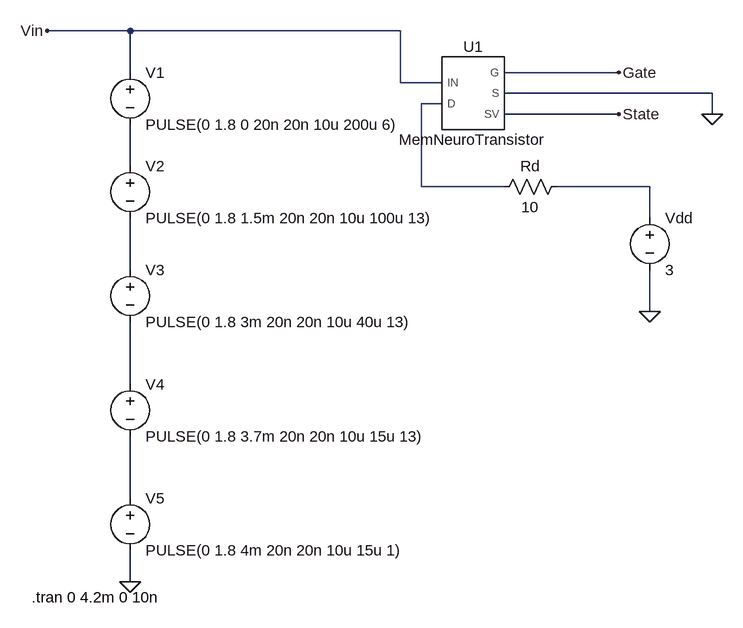
[diagram p0: schematic memNeuroTransistor.asc]
memNeuroTransistor.asc, the LTspice schematic file:
Version 4
SHEET 1 880 744
WIRE -304 -144 -432 -144
WIRE 112 -144 -304 -144
WIRE -304 -80 -304 -144
WIRE 448 -80 272 -80
WIRE 112 -64 112 -144
WIRE 176 -64 112 -64
WIRE 592 -48 272 -48
WIRE 176 -32 144 -32
WIRE 448 -16 272 -16
WIRE 592 -16 592 -48
WIRE -304 64 -304 0
WIRE 144 96 144 -32
WIRE 272 96 144 96
WIRE 496 96 352 96
WIRE 496 144 496 96
WIRE -304 224 -304 144
WIRE 496 288 496 224
WIRE -304 400 -304 304
WIRE -304 576 -304 480
WIRE -304 704 -304 656
FLAG -304 704 0
FLAG 448 -16 State
FLAG 448 -80 Gate
FLAG -432 -144 Vin
FLAG 496 288 0
FLAG 592 -16 0
SYMBOL voltage -304 -96 R0
WINDOW 123 0 0 Left 0
WINDOW 39 0 0 Left 0
SYMATTR InstName V1
SYMATTR Value PULSE(0 1.8 0 20n 20n 10u 200u 6)
SYMBOL voltage -304 48 R0
WINDOW 123 0 0 Left 0
WINDOW 39 0 0 Left 0
SYMATTR InstName V2
SYMATTR Value PULSE(0 1.8 1.5m 20n 20n 10u 100u 13)
SYMBOL voltage -304 208 R0
WINDOW 123 0 0 Left 0
WINDOW 39 0 0 Left 0
SYMATTR InstName V3
SYMATTR Value PULSE(0 1.8 3m 20n 20n 10u 40u 13)
SYMBOL voltage -304 384 R0
WINDOW 123 0 0 Left 0
WINDOW 39 0 0 Left 0
SYMATTR InstName V4
SYMATTR Value PULSE(0 1.8 3.7m 20n 20n 10u 15u 13)
SYMBOL voltage -304 560 R0
WINDOW 123 0 0 Left 0
WINDOW 39 0 0 Left 0
SYMATTR InstName V5
SYMATTR Value PULSE(0 1.8 4m 20n 20n 10u 15u 1)
SYMBOL res 368 80 R90
WINDOW 0 0 56 VBottom 2
WINDOW 3 32 56 VTop 2
SYMATTR InstName Rd
SYMATTR Value 10
SYMBOL voltage 496 128 R0
SYMATTR InstName Vdd
SYMATTR Value 3
SYMBOL MemNeuroTransistor 224 -48 R0
SYMATTR InstName U1
TEXT -456 728 Left 2 !.tran 0 4.2m 0 10n

The netlist it stands for:
* memNeuroTransistor.asc
V1 Vin N002 PULSE(0 1.8 0 20n 20n 10u 200u 6)
V2 N002 N004 PULSE(0 1.8 1.5m 20n 20n 10u 100u 13)
V3 N004 N005 PULSE(0 1.8 3m 20n 20n 10u 40u 13)
V4 N005 N006 PULSE(0 1.8 3.7m 20n 20n 10u 15u 13)
V5 N006 0 PULSE(0 1.8 4m 20n 20n 10u 15u 1)
Rd N003 N001 10
Vdd N003 0 3
XU1 Vin N001 Gate 0 State MemNeuroTransistor  ; pins IN D G S SV
.tran 0 4.2m 0 10n
.lib C:\Users\NAGARAJ V REDDY\Documents\NES\1SEM\NNMHA\Neuro-transistor-Simulation-with-Memristor-based-Memcapacitor-using-LTSPICE\Neurotransistor-main\Neurotransistor-main\MemNeuroTransistor.cir
.backanno
.end